# EasyEDA Pro project Type_C硬盘盒_2025-09-27_14-32-02.eprj, board PCB1
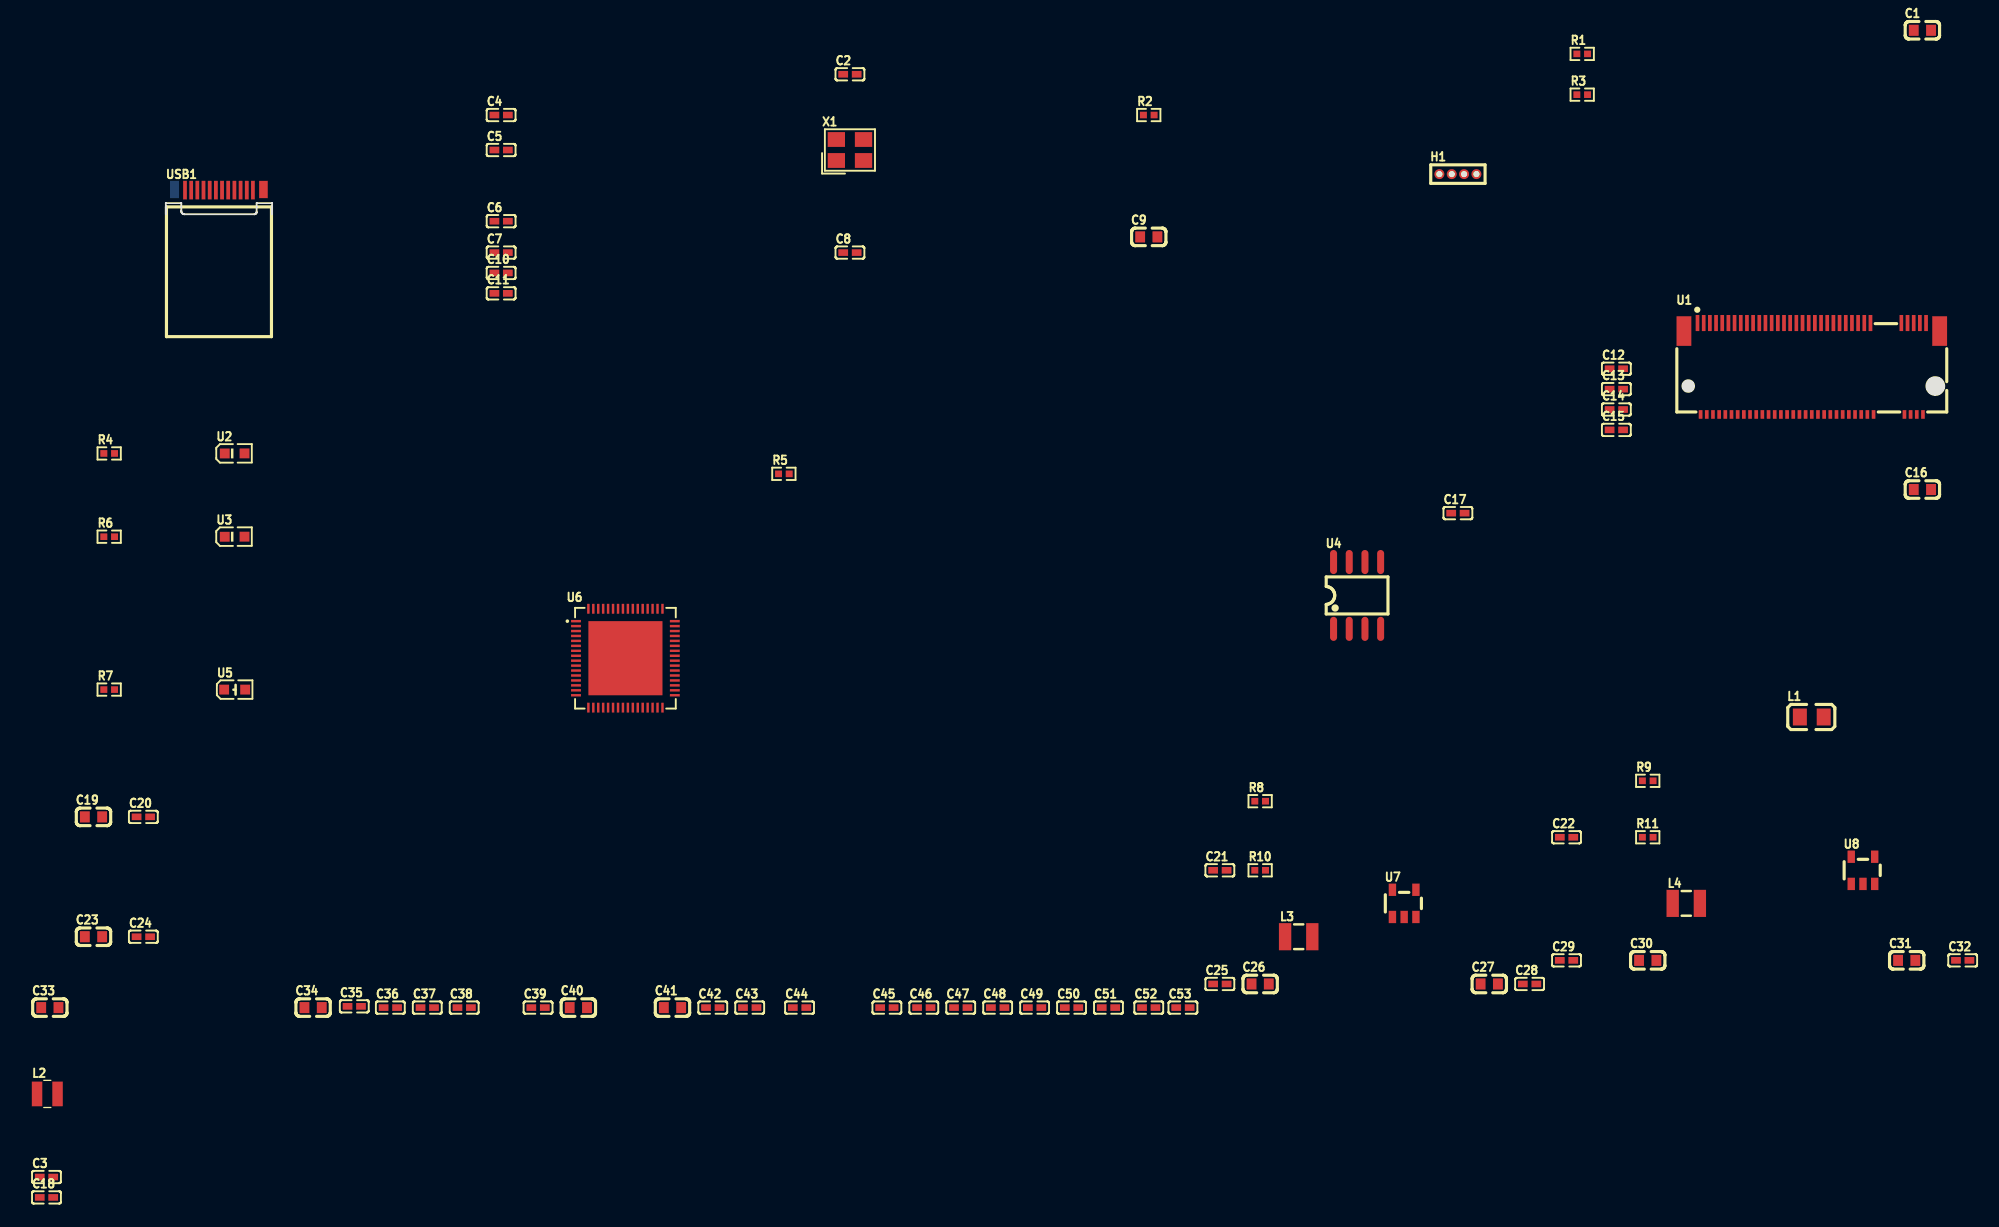
[diagram p2: board, top side]
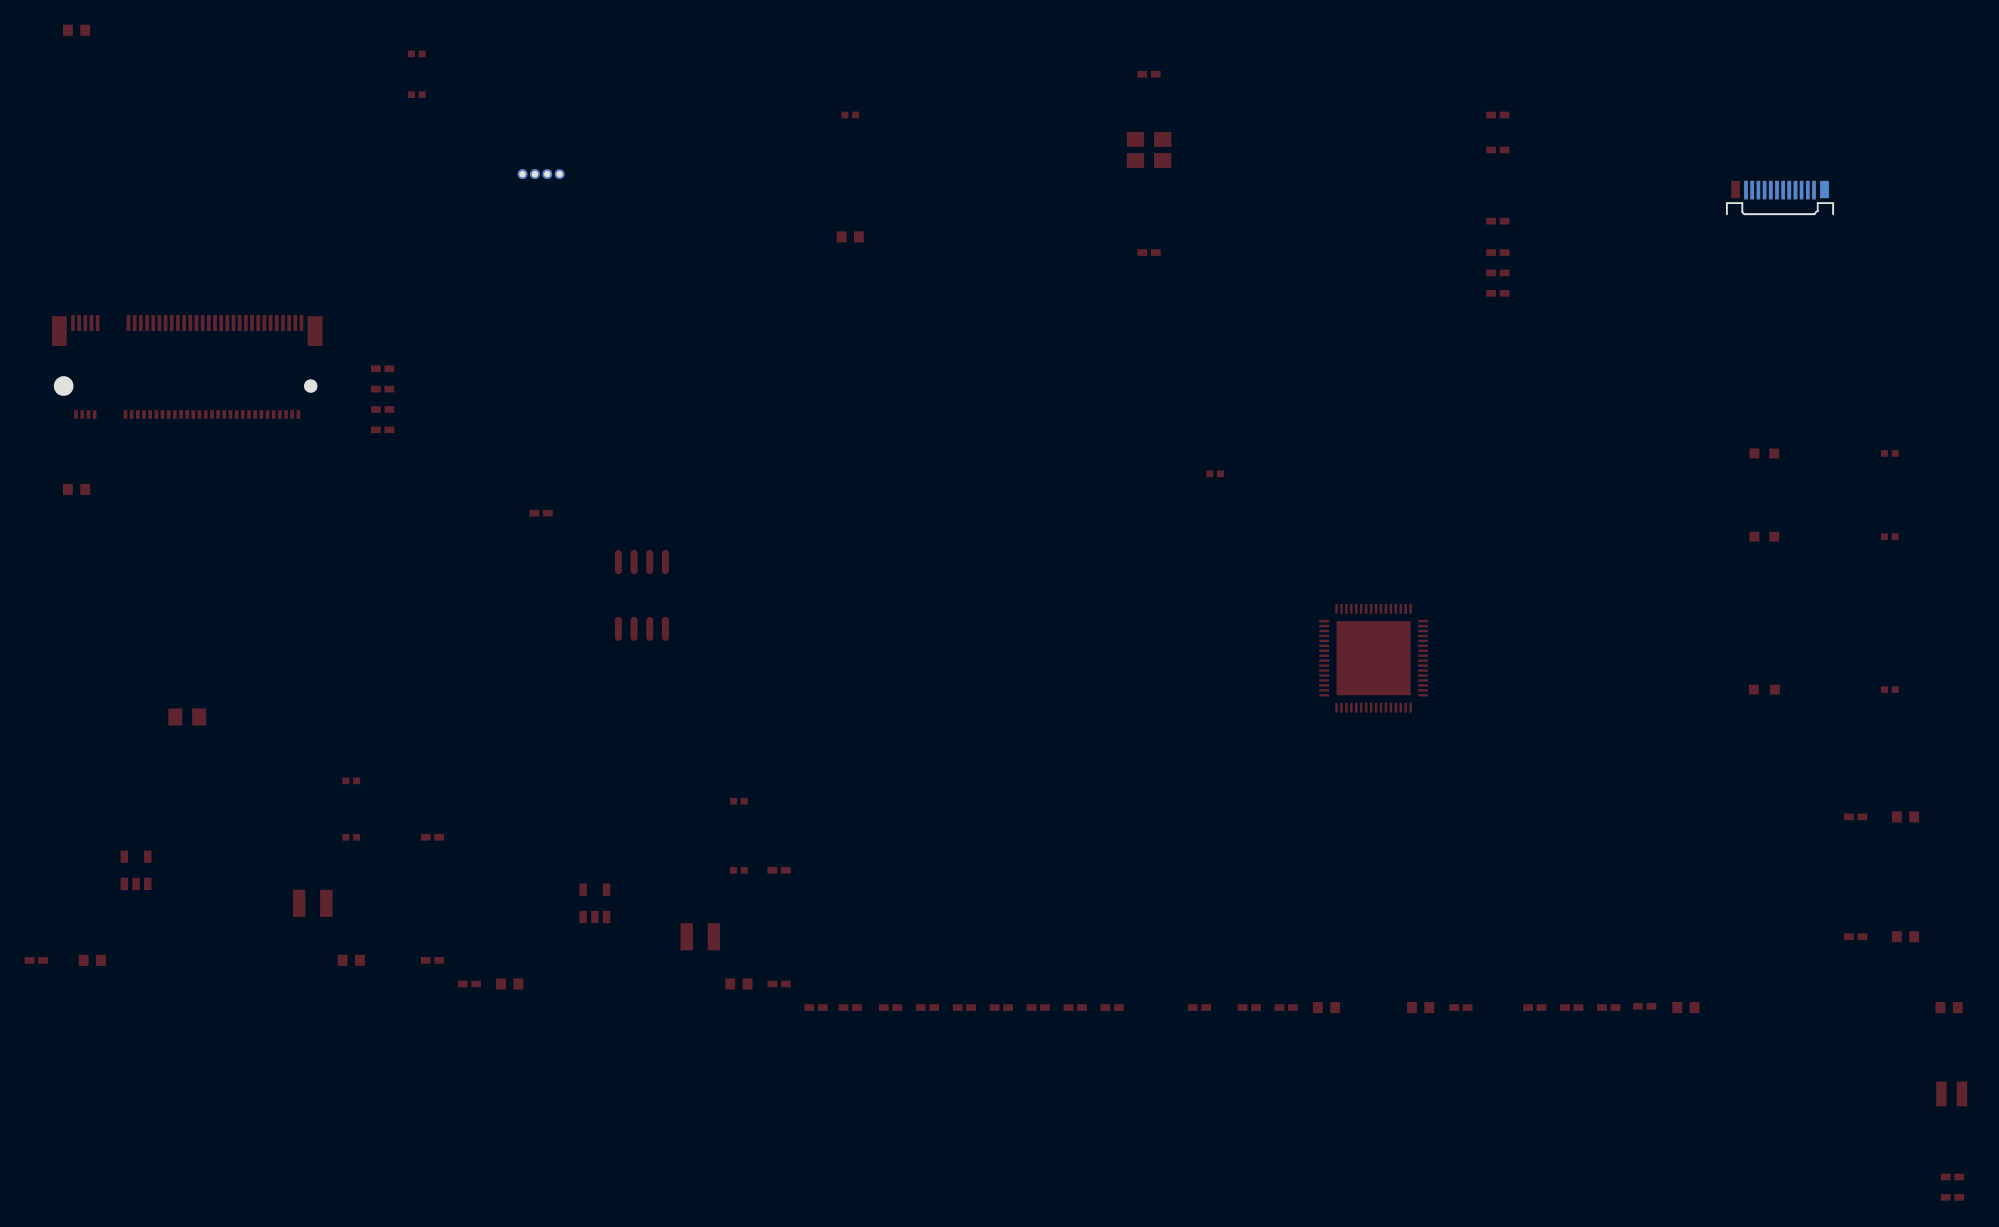
[diagram p3: board, bottom side, seen from below]

Outline 144.04 x 15.6 mm; copper layers: Top Layer, Bottom Layer. Coordinates in mm from the lower left corner of the outline.
Stack: Top Layer 0.035mm / Dielectric1 1.51mm FR4 er 4.5 / Bottom Layer 0.035mm

## Design rules (mm)
template: JLCPCB Capability(Two Layers Board)
spacing copperThickness1oz (default): track to track 0.102, other pairs 0.152 to 0.3
spacing copperThickness2oz: track to track 0.203, other pairs 0.152 to 0.3
track width copperThickness1oz (default): min 0.127, default 0.254, max 2.54
track width copperThickness2oz: min 0.203, default 0.254, max 2.54
differential pair differentialPair (default): width min 0.127, default 0.254, max 2.54; gap min 0.152, default 0.152
via viaSize (default): diameter min 0.5, default 0.61, max 10; hole min 0.3, default 0.305, max 6.3

## Placement (name value [footprint] x y rotation side)
C1  10uF  [C0603]  142.19 29.59 0 top
C2  20pF  [C0402]  55.38 26.03 0 top
C3  100nF  [C0402]  -9.66 -63.22 0 top
C4  330pF  [C0402]  27.14 22.73 0 top
C5  330pF  [C0402]  27.14 19.9 0 top
C6  100nF  [C0402]  27.14 14.14 0 top
C7  100nF  [C0402]  27.14 11.6 0 top
C8  20pF  [C0402]  55.38 11.6 0 top
C9  10uF  [C0603]  79.57 12.87 0 top
C10  100nF  [C0402]  27.14 9.95 0 top
C11  100nF  [C0402]  27.14 8.3 0 top
C12  220nF  [C0402]  117.42 2.2 0 top
C13  220nF  [C0402]  117.42 0.55 0 top
C14  220nF  [C0402]  117.42 -1.1 0 top
C15  220nF  [C0402]  117.42 -2.75 0 top
C16  10uF  [C0603]  142.19 -7.58 0 top
C17  100nF  [C0402]  104.59 -9.49 0 top
C18  100nF  [C0402]  -9.66 -64.87 0 top
C19  10uF  [C0603]  -5.86 -34.07 0 top
C20  100nF  [C0402]  -1.82 -34.07 0 top
C21  22pF  [C0402]  85.32 -38.4 0 top
C22  22pF  [C0402]  113.39 -35.72 0 top
C23  10uF  [C0603]  -5.86 -43.77 0 top
C24  100nF  [C0402]  -1.82 -43.77 0 top
C25  100nF  [C0402]  85.32 -47.6 0 top
C26  10uF  [C0603]  88.59 -47.6 0 top
C27  10uF  [C0603]  107.13 -47.6 0 top
C28  100nF  [C0402]  110.4 -47.6 0 top
C29  100nF  [C0402]  113.39 -45.69 0 top
C30  10uF  [C0603]  119.96 -45.69 0 top
C31  10uF  [C0603]  140.93 -45.69 0 top
C32  100nF  [C0402]  145.46 -45.69 0 top
C33  1uF  [C0603]  -9.39 -49.51 0 top
C34  1uF  [C0603]  11.92 -49.51 0 top
C35  100nF  [C0402]  15.25 -49.41 0 top
C36  100nF  [C0402]  18.17 -49.51 0 top
C37  100nF  [C0402]  21.16 -49.51 0 top
C38  100nF  [C0402]  24.15 -49.51 0 top
C39  100nF  [C0402]  30.13 -49.51 0 top
C40  4.7uF  [C0603]  33.39 -49.51 0 top
C41  4.7uF  [C0603]  41.01 -49.51 0 top
C42  100nF  [C0402]  44.28 -49.51 0 top
C43  100nF  [C0402]  47.26 -49.51 0 top
C44  100nF  [C0402]  51.3 -49.51 0 top
C45  100nF  [C0402]  58.37 -49.51 0 top
C46  100nF  [C0402]  61.36 -49.51 0 top
C47  100nF  [C0402]  64.35 -49.51 0 top
C48  100nF  [C0402]  67.34 -49.51 0 top
C49  100nF  [C0402]  70.33 -49.51 0 top
C50  100nF  [C0402]  73.32 -49.51 0 top
C51  100nF  [C0402]  76.31 -49.51 0 top
C52  100nF  [C0402]  79.57 -49.51 0 top
C53  100nF  [C0402]  82.33 -49.51 0 top
H1  ZX-PZ1.0-1-4PZZ  [HDR-TH_ZX-PZ1.0-1-4PZZ]  104.59 17.95 0 top
L1  BLM21PG600SN1D  [L0805]  133.24 -25.99 0 top
L2  4.7uH  [IND-SMD_L2.5-W2.0-VLS252012CX-150M]  -9.6 -56.5 0 top
L3  2.2uH  [IND-SMD_L2.5-W2.0_MHCHL2520]  91.71 -43.77 0 top
L4  2.2uH  [IND-SMD_L2.5-W2.0_MHCHL2520]  123.08 -41.07 0 top
R1  4.7kΩ  [R0402]  114.66 27.68 0 top
R2  50k  [R0402]  79.57 22.73 0 top
R3  4.7kΩ  [R0402]  114.66 24.38 0 top
R4  10kΩ  [R0402]  -4.59 -4.66 0 top
R5  12kΩ_1%  [R0402]  50.03 -6.31 0 top
R6  10kΩ  [R0402]  -4.59 -11.4 0 top
R7  10kΩ  [R0402]  -4.59 -23.77 0 top
R8  150kΩ_1%  [R0402]  88.59 -32.8 0 top
R9  22.1kΩ_1%  [R0402]  119.96 -31.15 0 top
R10  100kΩ_1%  [R0402]  88.59 -38.4 0 top
R11  100kΩ_1%  [R0402]  119.96 -35.72 0 top
U1  91302-225-067RCM  [CONN-SMD_91302-225-067RCM]  133.24 2.2 0 top
U2  LED_绿  [LED0603-RD_GREEN]  5.57 -4.66 0 top
U3  LED_绿  [LED0603-RD_GREEN]  5.57 -11.4 0 top
U4  W25X20CLSNIG  [SOIC-8_L5.0-W4.0-P1.27-LS6.0-BL]  96.43 -16.15 0 top
U5  LED_蓝  [LED0603-R-RD]  5.57 -23.77 0 top
U6  JMS583  [QFN-64_L8.0-W8.0-P0.40-TL-EP6.0]  37.2 -21.23 0 top
U7  ETA3409S2F  [SOT-23-5_L2.9-W1.6-P0.95-LS2.8-BL]  100.24 -41.07 0 top
U8  ETA3409S2F  [SOT-23-5_L2.9-W1.6-P0.95-LS2.8-BL]  137.38 -38.4 0 top
USB1  U261-241N-4BS60  [USB-TYPE-C-SMD_U261-241N-4BS60]  4.3 16.68 0 top
X1  25MHz  [CRYSTAL-SMD_4P-L3.2-W2.5-BL]  55.38 19.9 0 top

## Footprints (pads in the part's own frame, mm; a bottom-side part is the same pattern mirrored in y, then rotated)
C0402
  rect 0.79x0.54 smd: 1(-0.545,0) 2(0.545,0)
C0603
  rect 0.8x0.9 smd: 1(-0.7,0) 2(0.7,0)
CONN-SMD_91302-225-067RCM
  rect 0.3x1.3 smd: 1(-9.25,3.7) 3(-8.75,3.7) 5(-8.25,3.7) 7(-7.75,3.7) 9(-7.25,3.7) 11(-6.75,3.7) 13(-6.25,3.7) 15(-5.75,3.7) 17(-5.25,3.7) 19(-4.75,3.7) 21(-4.25,3.7) 23(-3.75,3.7) 25(-3.25,3.7) 27(-2.75,3.7) 29(-2.25,3.7) 31(-1.75,3.7) 33(-1.25,3.7) 35(-0.75,3.7) 37(-0.25,3.7) 39(0.25,3.7) 41(0.75,3.7) 43(1.25,3.7) 45(1.75,3.7) 47(2.25,3.7) 49(2.75,3.7) 51(3.25,3.7) 53(3.75,3.7) 55(4.25,3.7) 57(4.75,3.7) 67(7.25,3.7) 69(7.75,3.7) 71(8.25,3.7) 73(8.75,3.7) 75(9.25,3.7)
  rect 0.3x0.7 smd: 2(-9,-3.7) 4(-8.5,-3.7) 6(-8,-3.7) 8(-7.5,-3.7) 10(-7,-3.7) 12(-6.5,-3.7) 14(-6,-3.7) 16(-5.5,-3.7) 18(-5,-3.7) 20(-4.5,-3.7) 22(-4,-3.7) 24(-3.5,-3.7) 26(-3,-3.7) 28(-2.5,-3.7) 30(-2,-3.7) 32(-1.5,-3.7) 34(-1,-3.7) 36(-0.5,-3.7) 38(0,-3.7) 40(0.5,-3.7) 42(1,-3.7) 44(1.5,-3.7) 46(2,-3.7) 48(2.5,-3.7) 50(3,-3.7) 52(3.5,-3.7) 54(4,-3.7) 56(4.5,-3.7) 58(5,-3.7) 68(7.5,-3.7) 70(8,-3.7) 72(8.5,-3.7) 74(9,-3.7)
  rect 1.2x2.4 smd: 76(-10.35,3.05) 77(10.35,3.05)
CRYSTAL-SMD_4P-L3.2-W2.5-BL
  rect 1.4x1.2 smd: 1(-1.1,-0.85) 2(1.1,-0.85) 3(1.1,0.85) 4(-1.1,0.85)
HDR-TH_ZX-PZ1.0-1-4PZZ
  round 0.8 hole 0.5: 1(-1.5,0) 2(-0.5,0) 3(0.5,0) 4(1.5,0)
IND-SMD_L2.5-W2.0-VLS252012CX-150M
  rect 0.85x2 smd: 1(-0.83,0) 2(0.83,0)
IND-SMD_L2.5-W2.0_MHCHL2520
  rect 1x2.2 smd: 1(-1.1,0) 2(1.1,0)
L0805
  rect 1.133x1.377 smd: 1(-0.966,0) 2(0.966,0)
LED0603-R-RD
  rect 0.8x0.8 smd: 1(0.851,0) 2(-0.851,0)
LED0603-RD_GREEN
  rect 0.8x0.8 smd: 1(-0.799,-0.004) 2(0.799,0.004)
QFN-64_L8.0-W8.0-P0.40-TL-EP6.0
  rect 0.8x0.2 smd: 1(-4,3) 2(-4,2.6) 3(-4,2.2) 4(-4,1.8) 5(-4,1.4) 6(-4,1) 7(-4,0.6) 8(-4,0.2) 9(-4,-0.2) 10(-4,-0.6) 11(-4,-1) 12(-4,-1.4) 13(-4,-1.8) 14(-4,-2.2) 15(-4,-2.6) 16(-4,-3) 33(4,-3) 34(4,-2.6) 35(4,-2.2) 36(4,-1.8) 37(4,-1.4) 38(4,-1) 39(4,-0.6) 40(4,-0.2) 41(4,0.2) 42(4,0.6) 43(4,1) 44(4,1.4) 45(4,1.8) 46(4,2.2) 47(4,2.6) 48(4,3)
  rect 0.2x0.8 smd: 17(-3,-4) 18(-2.6,-4) 19(-2.2,-4) 20(-1.8,-4) 21(-1.4,-4) 22(-1,-4) 23(-0.6,-4) 24(-0.2,-4) 25(0.2,-4) 26(0.6,-4) 27(1,-4) 28(1.4,-4) 29(1.8,-4) 30(2.2,-4) 31(2.6,-4) 32(3,-4) 49(3,4) 50(2.6,4) 51(2.2,4) 52(1.8,4) 53(1.4,4) 54(1,4) 55(0.6,4) 56(0.2,4) 57(-0.2,4) 58(-0.6,4) 59(-1,4) 60(-1.4,4) 61(-1.8,4) 62(-2.2,4) 63(-2.6,4) 64(-3,4)
  rect 6x6 smd: 65(0,0)
R0402
  rect 0.566x0.54 smd: 1(-0.433,0) 2(0.433,0)
SOIC-8_L5.0-W4.0-P1.27-LS6.0-BL
  oval 0.569x1.95 smd: 1(-1.905,-2.705) 2(-0.635,-2.705) 3(0.635,-2.705) 4(1.905,-2.705) 5(1.905,2.705) 6(0.635,2.705) 7(-0.635,2.705) 8(-1.905,2.705)
SOT-23-5_L2.9-W1.6-P0.95-LS2.8-BL
  rect 0.6x1 smd: 1(-0.95,-1.1) 2(0,-1.1) 3(0.95,-1.1) 4(0.95,1.1) 5(-0.95,1.1)
USB-TYPE-C-SMD_U261-241N-4BS60
  rect 0.7x1.4 smd far side: 1(-3.6,0.025)
  rect 0.7x1.4 smd: 2(3.6,0.025)
  rect 0.3x1.5 smd: A1(2.75,-0.025) A2(2.25,-0.025) A3(1.75,-0.025) A4(1.25,-0.025) A5(0.75,-0.025) A6(0.25,-0.025) A7(-0.25,-0.025) A8(-0.75,-0.025) A9(-1.25,-0.025) A10(-1.75,-0.025) A11(-2.25,-0.025) A12(-2.75,-0.025)
  rect 0.3x1.5 smd far side: B1(-2.75,-0.025) B2(-2.25,-0.025) B3(-1.75,-0.025) B4(-1.25,-0.025) B5(-0.75,-0.025) B6(-0.25,-0.025) B7(0.25,-0.025) B8(0.75,-0.025) B9(1.25,-0.025) B10(1.75,-0.025) B11(2.25,-0.025) B12(2.75,-0.025)

## Nets
As in the schematic, except:
GND: C1.2 C2.1 C3.1 C4.2 C5.2 C8.1 C9.1 C16.2 C17.1 C18.1 C19.1 C20.1 C23.1 C24.1 C25.1 C26.1 C27.1 C28.1 C29.1 C30.1 C31.1 C32.1 C33.1 C34.1 C35.1 C36.1 C37.1 C38.1 C39.1 C40.1 C41.1 C42.1 C43.1 C44.1 C45.1 C46.1 C47.1 C48.1 C49.1 C50.1 C51.1 C52.1 C53.1 H1.4 R5.2 R8.1 R9.1 U1.1 U1.3 U1.9 U1.15 U1.21 U1.27 U1.33 U1.39 U1.45 U1.51 U1.57 U1.71 U1.73 U1.75 U1.76 U1.77 U2.1 U3.1 U4.4 U5.2 U6.60 U6.63 U6.65 U7.2 U8.2 USB1.1 USB1.2 USB1.A1 USB1.A12 USB1.B1 USB1.B12 X1.2 X1.4
VCC: C17.2 C34.2 C35.2 C36.2 C37.2 C38.2 C39.2 H1.1 R2.1 R4.1 U4.3 U4.7 U4.8 U6.6 U6.11 U6.19 U6.32 U6.52 U6.56
P0_TX_N: C15.1 U6.44
P0_TX_P: C14.1 U6.45

Pads without a net: R1 2; R3 2; U1 5 6 7 8 10 11 13 17 19 20 22 23 24 25 26 28 30 32 34 36 38 40 42 44 46 48 54 56 58 67 68 69; U6 9 10 12 57 58 59
